# EAGLE design pascal (EAGLE 9.6.2)
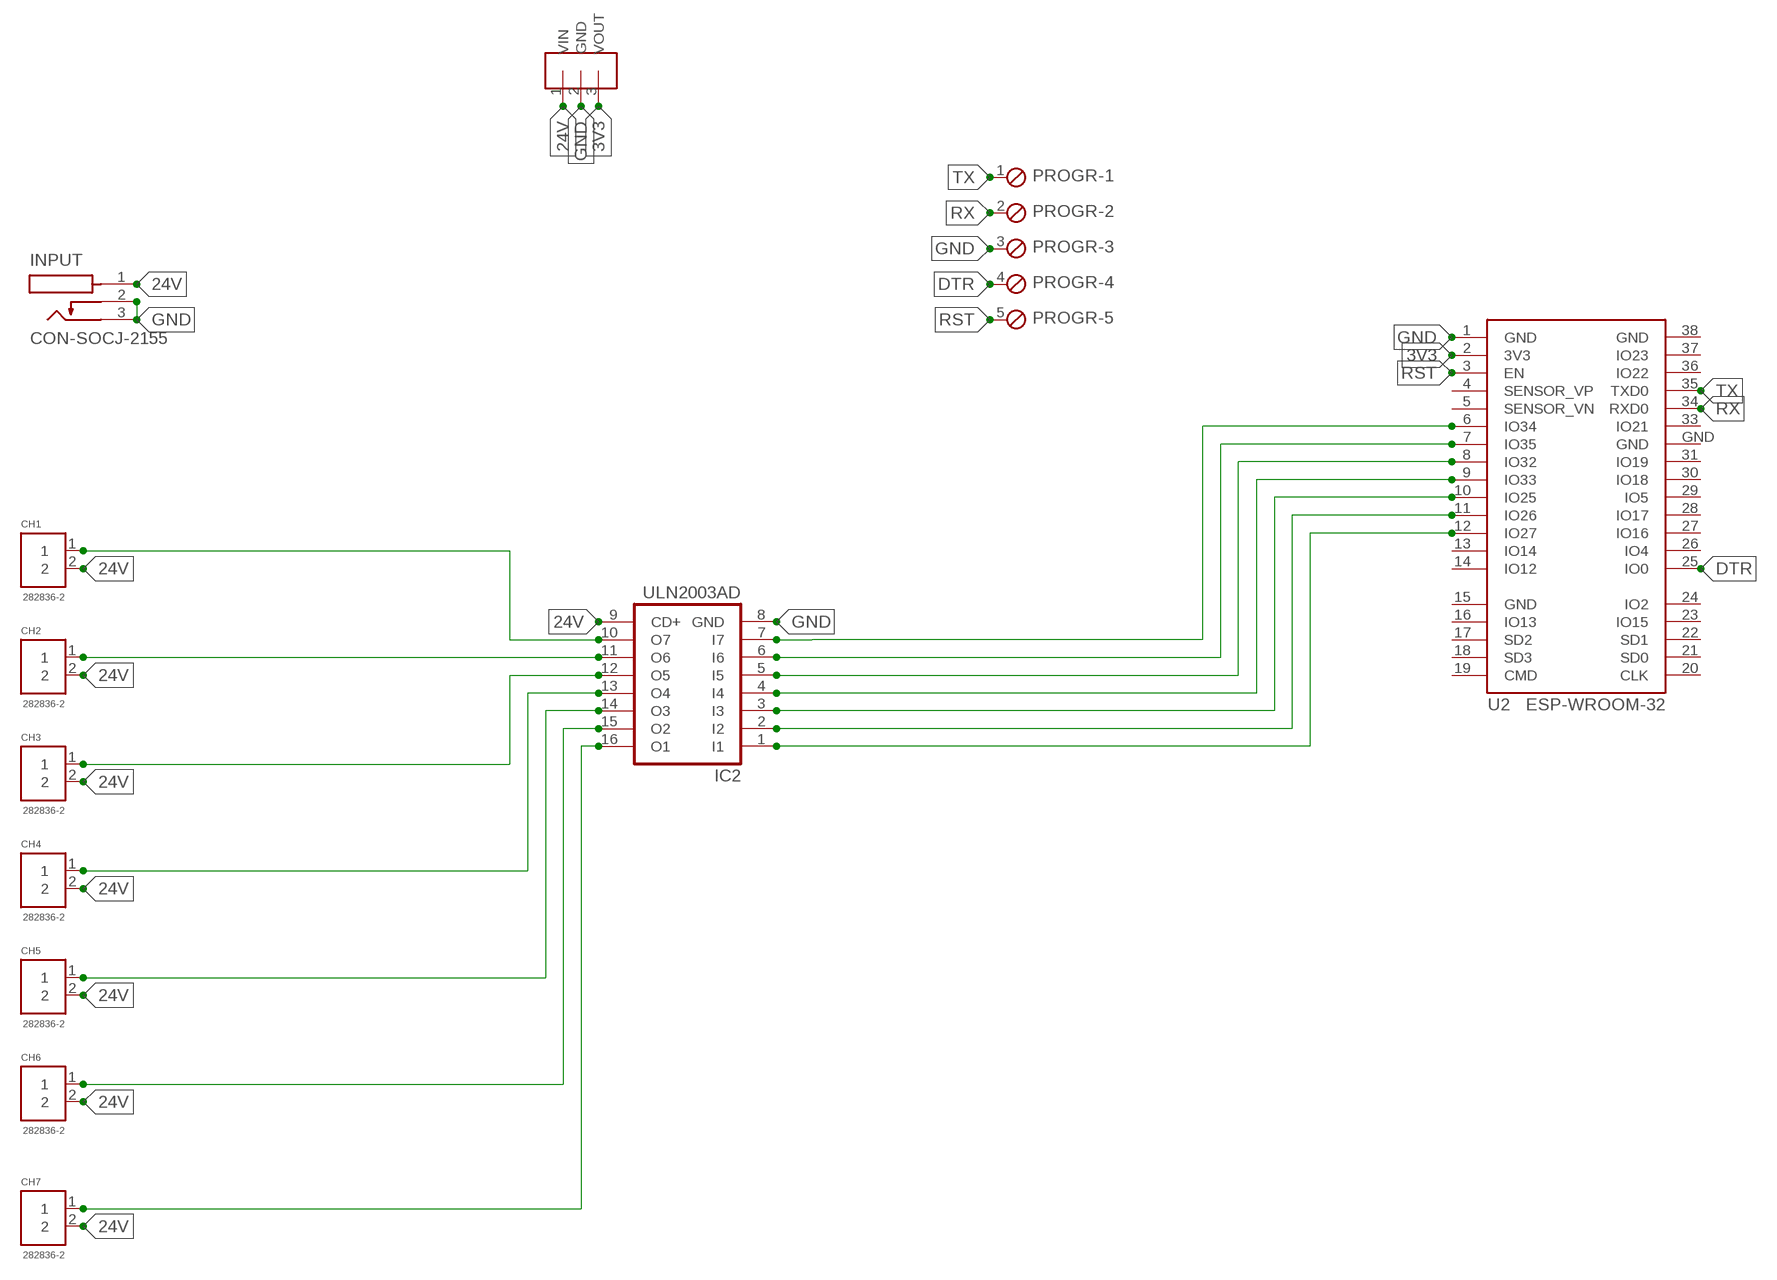
[diagram p0: schematic, sheet 1]

## Parts
CH1  282836-2  [CONN_282836-2]
CH2  282836-2  [CONN_282836-2]
CH3  282836-2  [CONN_282836-2]
CH4  282836-2  [CONN_282836-2]
CH5  282836-2  [CONN_282836-2]
CH6  282836-2  [CONN_282836-2]
CH7  282836-2  [CONN_282836-2]
IC2  ULN2003AD  [SO16]
INPUT  CON-SOCJ-2155  [GRAVITECH_CON-SOCJ-2155]
PROGR  MPT5  [5POL254]
U2  ESP-WROOM-32  [ESP-WROOM-32]
U$1  OKI-78SR-3.3/1.5  [CONV_OKI-78SR-5/1.5-W36-C]

## Nets
3V3: U2.2(3V3) U$1.3(VOUT)
24V: CH1.2 CH2.2 CH3.2 CH4.2 CH5.2 CH6.2 CH7.2 IC2.9(CD+) INPUT.1 U$1.1(VIN)
DTR: PROGR.4 U2.25(IO0)
GND: IC2.8(GND) INPUT.2 INPUT.3 PROGR.3 U2.1(GND) U$1.2(GND)
N$3: IC2.7(I7) U2.6(IO34)
N$5: IC2.6(I6) U2.7(IO35)
N$6: IC2.5(I5) U2.8(IO32)
N$10: CH3.1 IC2.12(O5)
N$12: CH1.1 IC2.10(O7)
N$14: CH2.1 IC2.11(O6)
N$16: CH4.1 IC2.13(O4)
N$17: CH5.1 IC2.14(O3)
N$18: CH6.1 IC2.15(O2)
N$19: CH7.1 IC2.16(O1)
N$20: IC2.4(I4) U2.9(IO33)
N$21: IC2.3(I3) U2.10(IO25)
N$22: IC2.2(I2) U2.11(IO26)
N$23: IC2.1(I1) U2.12(IO27)
RST: PROGR.5 U2.3(EN)
RX: PROGR.2 U2.34(RXD0)
TX: PROGR.1 U2.35(TXD0)
Unconnected: U2.4(SENSOR_VP) U2.5(SENSOR_VN) U2.13(IO14) U2.14(IO12) U2.16(IO13) U2.17(SD2) U2.18(SD3) U2.19(CMD) U2.20(CLK) U2.21(SD0) U2.22(SD1) U2.23(IO15) U2.24(IO2) U2.26(IO4) U2.27(IO16) U2.28(IO17) U2.29(IO5) U2.30(IO18) U2.31(IO19) U2.33(IO21) U2.36(IO22) U2.37(IO23)

## Power pins joined to a net without a drawn wire
GND: U2.15(GND) U2.38(GND) U2.GND

## Library data of the parts
CH1-CH7 = 282836-2:282836-2: TERM BLOCK 2POS SIDE ENTRY 5MM Check prices <https://pricing.snapeda.com/parts/282836-2/TE%20Connectivity/view-part?ref=eda>; AVAILABILITY: Good; CENTERLINE_PITCH: 5 mm[.197 in]; COMMENT: 282836-2; DESCRIPTION: Connector, Terminal Block; Wire Receptacle; 2 Pos.; 16-30 AWG; 0.197 in. CL; Sid; EU_ROHS_COMPLIANCE: Compliant with Exemptions; MF: TE Connectivity; MP: 282836-2; NUMBER_OF_POSITIONS: 2; PACKAGE: None; PRICE: None; PURCHASE-URL: https://pricing.snapeda.com/search/part/282836-2/?ref=eda
IC2 = uln-udn:ULN2003A: DRIVER ARRAY
INPUT = CON-SOCJ-2155:CON-SOCJ-2155: DC Power Connectors Power Jack/Connector 2.1mm x 5.5mm Check prices <https://pricing.snapeda.com/parts/CON-SOCJ-2155/Gravitech/view-part?ref=eda>; AVAILABILITY: Warning; DESCRIPTION: DC Power Connectors Power Jack/Connector 2.1mm x 5.5mm; MF: Gravitech; MP: CON-SOCJ-2155; PACKAGE: None; PRICE: None; PURCHASE-URL: https://pricing.snapeda.com/search/part/CON-SOCJ-2155/?ref=eda
PROGR = con-phoenix-254:MPT5: PHOENIX CONNECTOR; OC_FARNELL: unknown; OC_NEWARK: unknown
U2 = esp32:ESP-WROOM-32: Espressif Systems ESP-WROOM-32
U$1 = CONV_OKI-78SR-5_1.5-W36-C:OKI-78SR-3.3/1.5

## Board
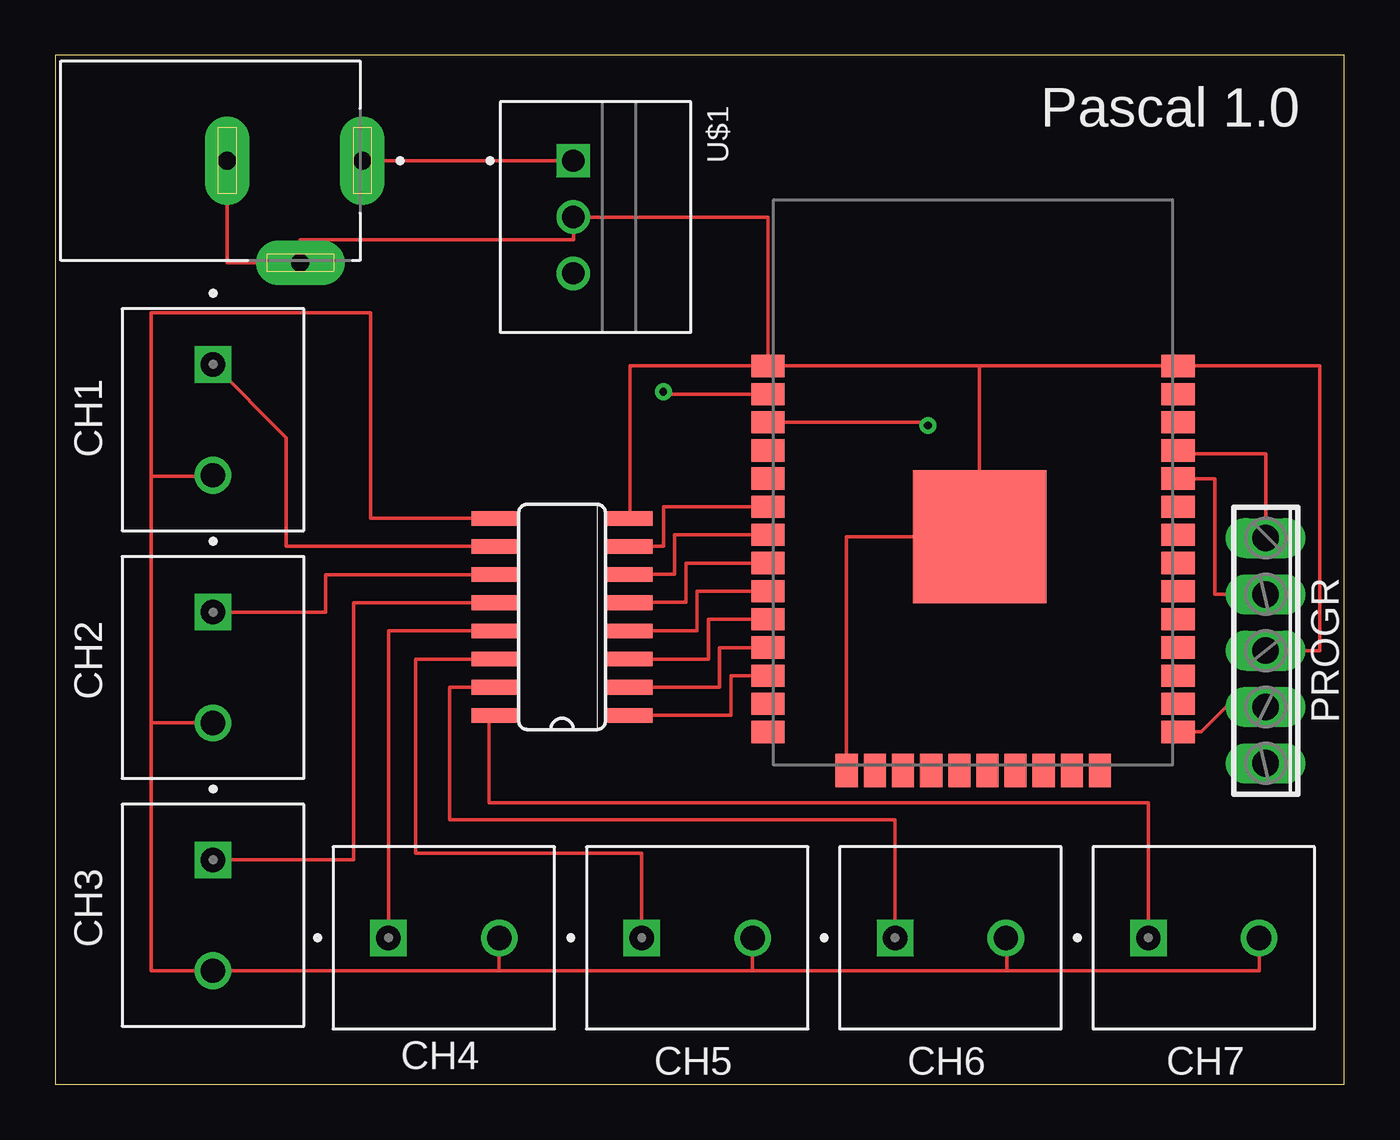
[diagram p1: board, top side]
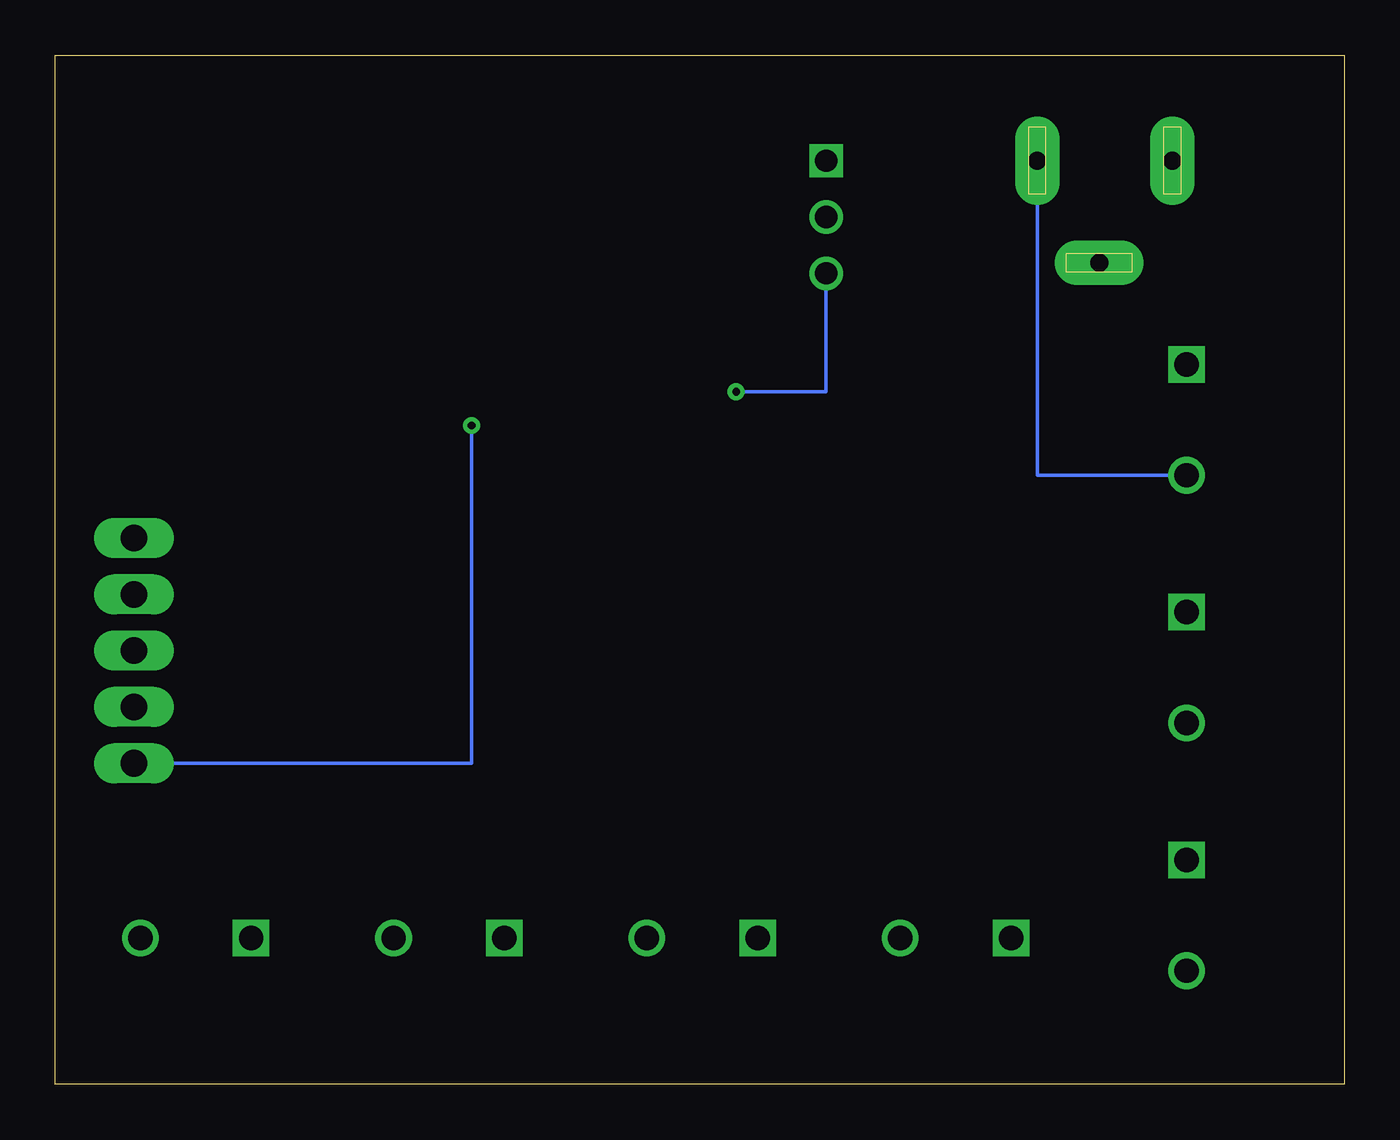
[diagram p2: board, bottom side, seen from below]

Size 58.15 x 46.41 mm. Coordinates in mm from the lower left corner, seen from the top.
Outline: 0,0 58.15,0 58.15,46.41 0,46.41 0,0
Copper layers (1*16): Top 0.035mm / dielectric 1.5mm / Bottom 0.035mm
Design rules "default": minimum track width 6mil, minimum drill 0.35mm, track to track 6mil, track to pad 6mil, pad to pad 6mil, via to via 6mil, smd to smd 6mil, copper to edge 40mil, drill to drill 6mil, minimum pad ring 10mil, minimum via ring 8mil, stop-mask expansion 4mil, vias tented up to drill 0mil, thermal gap 10mil

### Footprints (pad centres in the part's own frame; a part is rotated, then mirrored left to right if it is on the bottom)
CONN_282836-2 = drill 1.1 square: 1 -2.5,0 | drill 1.1: 2 2.5,0
SO16 = smd 0.66 x 2.032: 1 -4.445,-3.073; 2 -3.175,-3.073; 3 -1.905,-3.073; 4 -0.635,-3.073; 5 0.635,-3.073; 6 1.905,-3.073; 7 3.175,-3.073; 8 4.445,-3.073; 9 4.445,3.073; 10 3.175,3.073; 11 1.905,3.073; 12 0.635,3.073; 13 -0.635,3.073; 14 -1.905,3.073; 15 -3.175,3.073; 16 -4.445,3.073
GRAVITECH_CON-SOCJ-2155 = drill 0.8 pad 2 long: 1 6.1,0; 2 3.3,-4.6; 3 0,0
5POL254 = drill 1.2 long: 1 -5.08,0; 2 -2.54,0; 3 0,0; 4 2.54,0; 5 5.08,0
ESP-WROOM-32 = smd 1.5 x 1: 1 -9.25,7; 2 -9.25,5.73; 3 -9.25,4.46; 4 -9.25,3.19; 5 -9.25,1.92; 6 -9.25,0.65; 7 -9.25,-0.62; 8 -9.25,-1.89; 9 -9.25,-3.16; 10 -9.25,-4.43; 11 -9.25,-5.7; 12 -9.25,-6.97; 13 -9.25,-8.24; 14 -9.25,-9.51; 25 9.25,-9.51; 26 9.25,-8.24; 27 9.25,-6.97; 28 9.25,-5.7; 29 9.25,-4.43; 30 9.25,-3.16; 31 9.25,-1.89; 32 9.25,-0.62; 33 9.25,0.65; 34 9.25,1.92; 35 9.25,3.19; 36 9.25,4.46; 37 9.25,5.73; 38 9.25,7 | smd 1 x 1.5: 15 -5.7,-11.25; 16 -4.43,-11.25; 17 -3.16,-11.25; 18 -1.89,-11.25; 19 -0.62,-11.25; 20 0.65,-11.25; 21 1.92,-11.25; 22 3.19,-11.25; 23 4.46,-11.25; 24 5.73,-11.25 | smd 6 x 6: GND 0.3,-0.7
CONV_OKI-78SR-5/1.5-W36-C = drill 1 pad 1.5 square: 1 -2.54,0 | drill 1 pad 1.5: 2 0,0; 3 2.54,0

### Placement (x,y rotation side)
CH1  7.11,29.97 270 top
CH2  7.11,18.8 270 top
CH3  7.11,7.62 270 top
CH4  17.53,6.6 0 top
CH5  28.96,6.6 0 top
CH6  40.39,6.6 0 top
CH7  51.82,6.6 0 top
IC2  22.86,21.08 90 top
INPUT  7.75,41.66 0 top
PROGR  54.61,19.56 270 top
U2  41.4,25.4 0 top
U$1  23.37,39.12 270 top

### Tracks (layer width: path | path; a pad name or v marks a point on that pad's centre or on a via)
3V3  (via drill 0.35)
  Top 0.152: U2.2 27.43,31.13 v27.43,31.24
  Bottom 0.152: v27.43,31.24 23.37,31.24 U$1.3
24V
  Top 0.152: IC2.9 14.22,25.53 14.22,34.8 4.32,34.8 4.32,27.43 | 4.32,27.43 4.32,16.3 | 4.32,16.3 4.32,5.12 CH3.2 20.03,5.12 | CH2.2 4.32,16.3 | CH1.2 7.11,27.43 4.32,27.43 | 20.03,5.12 31.46,5.12 | 31.46,5.12 42.93,5.12 | 42.93,5.12 54.32,5.12 CH7.2 | CH6.2 42.93,6.6 42.93,5.12 | CH5.2 31.46,5.12 | CH4.2 20.03,5.12 | INPUT.1 U$1.1
  Bottom 0.152: INPUT.1 13.85,27.47 CH1.2
DTR
  Top 0.152: PROGR.4 52.83,17.02 51.7,15.89 U2.25
GND
  Top 0.152: 41.7,32.4 U2.38 57.05,32.4 57.05,19.56 PROGR.3 | 41.7,32.4 U2.GND 35.7,24.7 U2.15 | U2.1 41.7,32.4 | INPUT.3 7.75,37.06 INPUT.2 11.05,38.1 23.37,38.1 U$1.2 32.15,39.12 U2.1 | U2.1 25.93,32.4 IC2.8
N$3
  Top 0.152: U2.6 27.43,26.05 27.43,24.27 25.95,24.27 IC2.7
N$5
  Top 0.152: U2.7 27.94,24.78 27.94,23 25.95,23 IC2.6
N$6
  Top 0.152: U2.8 28.45,23.51 28.45,21.73 25.95,21.73 IC2.5
N$10
  Top 0.152: IC2.12 13.46,21.72 13.46,10.12 CH3.1
N$12
  Top 0.152: IC2.10 10.41,24.26 10.41,29.17 CH1.1
N$14
  Top 0.152: IC2.11 12.19,22.99 12.19,21.3 CH2.1
N$16
  Top 0.152: IC2.13 15.03,20.45 CH4.1
N$17
  Top 0.152: IC2.14 16.26,19.18 16.26,10.41 26.46,10.41 CH5.1
N$18
  Top 0.152: IC2.15 17.78,17.91 17.78,11.94 37.89,11.94 CH6.1
N$19
  Top 0.152: IC2.16 19.56,16.64 19.56,12.7 49.32,12.7 CH7.1
N$20
  Top 0.152: U2.9 28.96,22.24 28.96,20.45 IC2.4
N$21
  Top 0.152: U2.10 29.46,20.97 29.46,19.18 IC2.3
N$22
  Top 0.152: U2.11 29.97,19.7 29.97,17.91 IC2.2
N$23
  Top 0.152: IC2.1 25.95,16.65 30.48,16.65 30.48,18.43 U2.12
RST  (via drill 0.35)
  Top 0.152: v39.37,29.72 39.23,29.86 U2.3
  Bottom 0.152: v39.37,29.72 39.37,14.48 PROGR.5
RX
  Top 0.152: PROGR.2 52.32,22.1 52.32,27.32 U2.34
TX
  Top 0.152: PROGR.1 54.61,28.45 50.79,28.45 U2.35

### Text on the board
tNames: Pascal 1.0